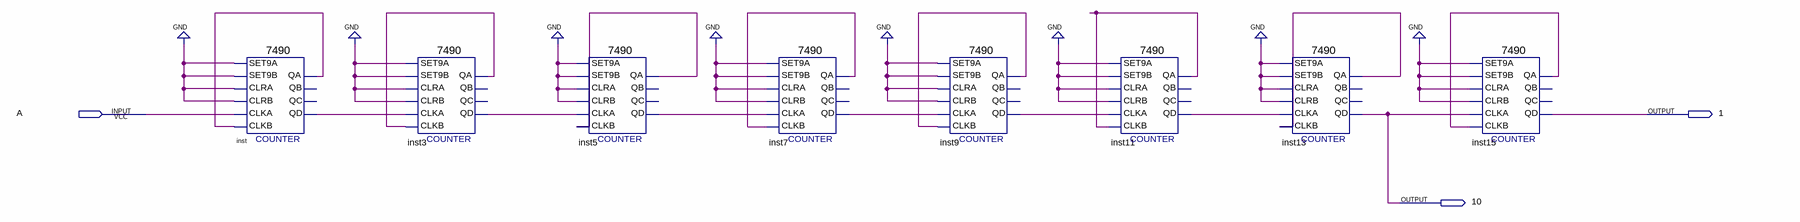
[diagram p0: schematic sheet]
// Quartus schematic 1227-1.bdf as structural Verilog: 8 symbols, 3 pins
module \1227-1  (
  input  A,
  output \1 ,
  output \10 
);

  wire inst3_qa, inst3_qd, inst5_qa, inst5_qd, inst7_qa, inst7_qd, inst9_qa, inst9_qd, inst11_qa, inst11_qd,
       inst13_qa, inst15_qa, inst_qa, inst_qd;

  \7490  inst (
    .SET9A(1'b0), .CLRA(1'b0), .SET9B(1'b0), .CLKB(inst_qa), .CLKA(A), .CLRB(1'b0), .QD(inst_qd), .QA(inst_qa));  // open: QB, QC
  \7490  inst3 (
    .SET9A(1'b0), .CLRA(1'b0), .SET9B(1'b0), .CLKB(inst3_qa), .CLKA(inst_qd), .CLRB(1'b0), .QD(inst3_qd),
    .QA(inst3_qa));  // open: QB, QC
  \7490  inst5 (
    .SET9A(1'b0), .CLRA(1'b0), .SET9B(1'b0), .CLKB(inst5_qa), .CLKA(inst3_qd), .CLRB(1'b0), .QD(inst5_qd),
    .QA(inst5_qa));  // open: QB, QC
  \7490  inst7 (
    .SET9A(1'b0), .CLRA(1'b0), .SET9B(1'b0), .CLKB(inst7_qa), .CLKA(inst5_qd), .CLRB(1'b0), .QD(inst7_qd),
    .QA(inst7_qa));  // open: QB, QC
  \7490  inst9 (
    .SET9A(1'b0), .CLRA(1'b0), .SET9B(1'b0), .CLKB(inst9_qa), .CLKA(inst7_qd), .CLRB(1'b0), .QD(inst9_qd),
    .QA(inst9_qa));  // open: QB, QC
  \7490  inst11 (
    .SET9A(1'b0), .CLRA(1'b0), .SET9B(1'b0), .CLKB(inst11_qa), .CLKA(inst9_qd), .CLRB(1'b0), .QD(inst11_qd),
    .QA(inst11_qa));  // open: QB, QC
  \7490  inst13 (
    .SET9A(1'b0), .CLRA(1'b0), .SET9B(1'b0), .CLKB(inst13_qa), .CLKA(inst11_qd), .CLRB(1'b0), .QD(\10 ),
    .QA(inst13_qa));  // open: QB, QC
  \7490  inst15 (
    .SET9A(1'b0), .CLRA(1'b0), .SET9B(1'b0), .CLKB(inst15_qa), .CLKA(\10 ), .CLRB(1'b0), .QD(\1 ),
    .QA(inst15_qa));  // open: QB, QC
endmodule
